# Altium schematic sheet VapourPhaseController.SchDoc: Vapour Phase Reflow Shield
size A4
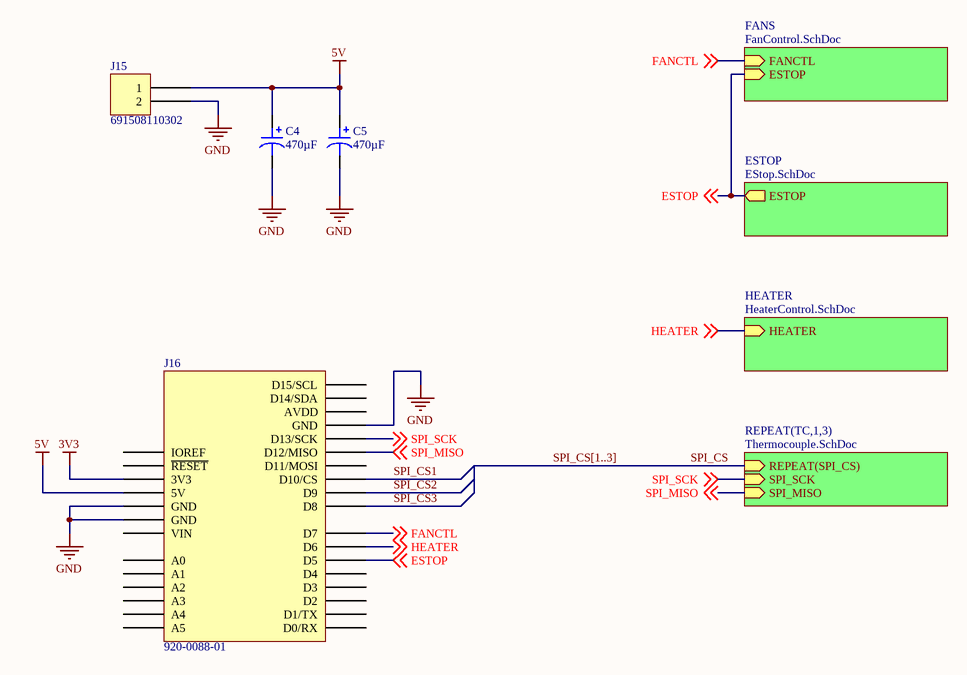
[diagram p0: VapourPhaseController.SchDoc]

## Parts
C4  470µF  [CAP AL TH D8 L3.5 H12.5]
C5  470µF  [CAP AL TH D8 L3.5 H12.5]
J15  691508110302  [WURTH 691508110302]
J16  920-0088-01  [SCHMARTBOARD - 920-0088-01]

## Sub-sheets
ESTOP = EStop.SchDoc: ESTOP (out)
FANS = FanControl.SchDoc: FANCTL (in), ESTOP (in)
HEATER = HeaterControl.SchDoc: HEATER (in)
REPEAT(TC,1,3) = Thermocouple.SchDoc: SPI_SCK (in), REPEAT(SPI_CS) (in), SPI_MISO (in)

## Nets
3V3: J16.4(3V3)
5V: C4.1 C5.1 J15.1 J16.5(5V)
GND: C4.2 C5.2 J15.2 J16.6(GND) J16.7(GND) J16.29(GND)
ESTOP: J16.20(D5) ; off-sheet ESTOP, sheet FANS/ESTOP, sheet ESTOP/ESTOP
FANCTL: J16.22(D7) ; off-sheet FANCTL, sheet FANS/FANCTL
HEATER: J16.21(D6) ; off-sheet HEATER, sheet HEATER/HEATER
SPI_CS: sheet REPEAT(TC,1,3)/REPEAT(SPI_CS)
SPI_CS1: J16.25(D10/CS)
SPI_CS2: J16.24(D9)
SPI_CS3: J16.23(D8)
SPI_MISO: J16.27(D12/MISO) ; off-sheet SPI_MISO, sheet REPEAT(TC,1,3)/SPI_MISO
SPI_SCK: J16.28(D13/SCK) ; off-sheet SPI_SCK, sheet REPEAT(TC,1,3)/SPI_SCK

Not connected (* = marked no-connect by the designer): J16 2(IOREF) 3(~{RESET}) 8(VIN) 9(A0) 10(A1) 11(A2) 12(A3) 13(A4) 14(A5) 15(D0/RX) 16(D1/TX) 17(D2) 18(D3) 19(D4) 26(D11/MOSI) 30(AVDD) 31(D14/SDA) 32(D15/SCL)

## Buses and harness runs
bus SPI_CS[1..3]

## Notes on the sheet
- Title
- Size:
- Date:
- A4
- Number:
- Time:
- Revision:
- Sheet
- of
- File:

## Library data of the parts
C4 C5 = ECA-1CM471: CAP ALUM 470UF 20% 16V RADIAL; Manufacturer: Panasonic Electronic Components; Lifetime @ Temp.: 2000 Hrs @ 85°C; Polarization: Polar; Ripple Current @ High Frequency: 748mA @ 10kHz; Ripple Current @ Low Frequency: 440mA @ 120Hz; Part Number: ECA-1CM471; Applications: General Purpose; Capacitance: 470µF; ComponentLink1Description: Datasheet; ComponentLink1URL: //media.digikey.com/pdf/Data%20Sheets/Panasonic%20Electronic%20Components/ECA-xxM%20Series,TypeA.pdf; ComponentLink2Description: DigiKey Link; ComponentLink2URL: http://digikey.com/product-detail/en/panasonic-electronic-components/ECA-1CM471/P5141-ND/245000; Device Package: Radial, Can; Height - Seated (Max): 0.492" (12.50mm); LastUpdated: 21/01/2020 03:40:57; Lead Spacing: 0.138" (3.50mm); Lifecycle Status: Active; Minimum Order: 1; Mounting Type: Through Hole; Operating Temperature: -40°C ~ 85°C; Package / Case: Radial, Can; Packaging: Bulk; PartId: 7263; Part Status: Active; Price: 0.10; Series: M; Size / Dimension: 0.315" Dia (8.00mm); Supplier 1: DigiKey; Supplier Part Number 1: P5141-ND; Tolerance: ±20%; Value: 470µF; Voltage - Rated: 16V
J15 = 691508110302: TERM BLOCK 2POS 3.5MM SMD; Manufacturer: Würth Elektronik; Current: 10A; Mating Orientation: Horizontal and Vertical with Board; Number of Levels: 1; Pitch: 0.138" (3.50mm); Positions Per Level: 2; Voltage: 300V; Wire Gauge: 16-30 AWG; Wire Termination: Screw - Rising Cage Clamp; Part Number: 691508110302; Color: Black; ComponentLink1Description: Datasheet; ComponentLink1URL: https://katalog.we-online.de/em/datasheet/6915081103xx.pdf; ComponentLink2Description: DigiKey Link; ComponentLink2URL: http://digikey.com/product-detail/en/w-rth-elektronik/691508110302/732-5963-1-ND/5047612; Features: Board Guide, Mounting Flange; LastUpdated: 15/01/2020 04:18:55; Lifecycle Status: Active; Minimum Order: 1; Mounting Type: Surface Mount; Packaging: TapeAndReel; Part Status: Active; Price: 1.57; Series: WR-TBL Series 5081; Supplier 1: DigiKey; Supplier Part Number 1: 732-5963-1-ND
J16 = 920-0088-01: CONN HDR 8/10P 0.1 GOLD PCB 6PC; Manufacturer: Schmartboard, Inc.; Connector Type: Header; Contact Length - Post: 0.413" (10.50mm); Number of Positions: 6, 8, 10; Number of Positions Loaded: All; Pitch - Mating: 0.100" (2.54mm); Style: Board to Board; ComponentLink1Description: Datasheet; ComponentLink1URL: http://schmartboard.com/content/Brochures/920-0088-01.pdf; ComponentLink2Description: DigiKey Link; ComponentLink2URL: http://digikey.com/product-detail/en/schmartboard-inc/920-0088-01/1988-1036-ND/9559319; Contact Finish - Mating: Gold; Contact Finish - Post: Gold; Contact Type: Female Socket; Fastening Type: Push-Pull; Insulation Color: Black; Insulation Height: 0.335" (8.51mm); LastUpdated: 31/01/2020 20:49:58; Lifecycle Status: Active; Part Number: 920-0088-01; Minimum Order: 1; Mounting Type: Through Hole; Number of Rows: 1; Packaging: Bulk; Part Status: Active; Price: 5.00; Series: -; Supplier 1: DigiKey; Supplier Part Number 1: 1988-1036-ND; Termination: Solder